# Altium project Lion tracker.PrjPCB
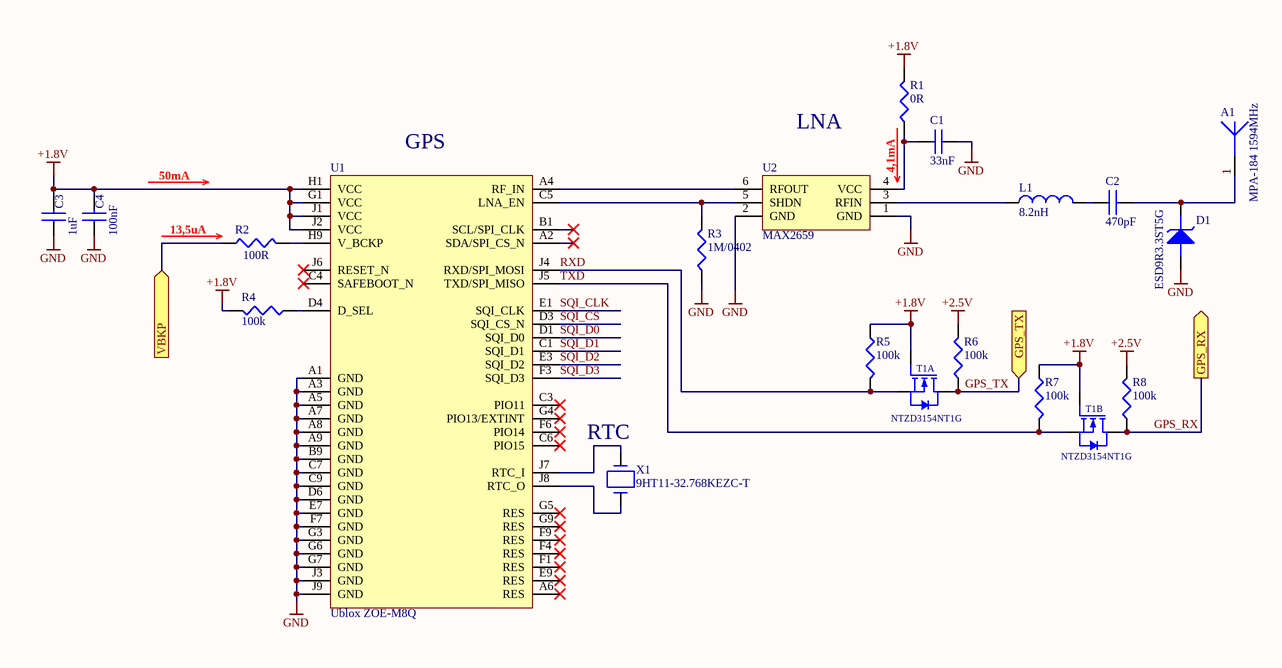
[diagram p0: GPS.SchDoc]
Company: IRNAS; CreateDate: 25.09.2019; PCBDesigner: Aleksej Cegner; ProjectTitle: Lion_Tracker; RevisionDate: 20.03.2019; Version: V1.4; Website: URL
1 sheet, 19 parts. Net scope: flat (ports and power ports of the same name join across sheets).
Board files: LION_TRACKER.PcbDoc, LION_TRACKER_PANEL.PcbDoc

## Sheet GPS.SchDoc
size A3; DocumentNumber: 3; SheetNumber: 3; SheetTotal: 5

### Parts
A1  MPA-184 1594MHz  [MPA-184]
C1  33nF  [CAP0402]
C2  470pF  [CAP0402]
C3  1uF  [CAP0402]
C4  100nF  [CAP0402]
D1  ESD9R3.3ST5G  [SOD-923]
L1  8.2nH  [IND0402]
R1  0R  [RES0402]
R2  100R  [RES0402]
R3  1M/0402  [RES0402]
R4  100k  [RES0402]
R5  100k  [RES0402]
R6  100k  [RES0402]
R7  100k  [RES0402]
R8  100k  [RES0402]
T1  NTZD3154NT1G  [SOT-563]  (parts A,B of 2)
U1  Ublox ZOE-M8Q  [S-LGA51]
U2  MAX2659  [uDFN-6]
X1  9HT11-32.768KEZC-T  [9HT11]

### Ports
GPS_RX (out), GPS_TX (in), VBKP (in)

### Nets
+1.8V: C3.2 C4.2 R1.2 R4.2 R5.1 R7.1 T1.2(G1) T1.5(G2) U1.G1(VCC) U1.H1(VCC) U1.J1(VCC) U1.J2(VCC)
+2.5V: R6.2 R8.2
GND: C1.1 C3.1 C4.1 D1.A(ANODE) R3.1 U1.A1(GND) U1.A3(GND) U1.A5(GND) U1.A7(GND) U1.A8(GND) U1.A9(GND) U1.B9(GND) U1.C7(GND) U1.C9(GND) U1.D6(GND) U1.E7(GND) U1.F7(GND) U1.G3(GND) U1.G6(GND) U1.G7(GND) U1.J3(GND) U1.J9(GND) U2.1(GND) U2.2(GND)
GPS_RX: R8.1 T1.3(D2) ; port GPS_RX
GPS_TX: R6.1 T1.6(D1) ; port GPS_TX
RXD: R5.2 T1.1(S1) U1.J4(RXD/SPI_MOSI)
SQI_CLK: U1.E1(SQI_CLK)
SQI_CS: U1.D3(SQI_CS_N)
SQI_D0: U1.D1(SQI_D0)
SQI_D1: U1.C1(SQI_D1)
SQI_D2: U1.E3(SQI_D2)
SQI_D3: U1.F3(SQI_D3)
TXD: R7.2 T1.4(S2) U1.J5(TXD/SPI_MISO)
VBKP: R2.1 ; port VBKP
NetA1_1: A1.1(ANT) C2.2 D1.K(cathode)
NetC1_2: C1.2 R1.1 U2.4(VCC)
NetC2_1: C2.1 L1.2
NetL1_1: L1.1 U2.3(RFIN)
NetR2_2: R2.2 U1.H9(V_BCKP)
NetR3_2: R3.2 U1.C5(LNA_EN) U2.5(SHDN)
NetR4_1: R4.1 U1.D4(D_SEL)
NetU1_A4: U1.A4(RF_IN) U2.6(RFOUT)
NetU1_J7: U1.J7(RTC_I) X1.2
NetU1_J8: U1.J8(RTC_O) X1.1

Not connected (* = marked no-connect by the designer): U1 A2(SDA/SPI_CS_N)* A6(RES)* B1(SCL/SPI_CLK)* C3(PIO11)* C4(SAFEBOOT_N)* C6(PIO15)* E9(RES)* F1(RES)* F4(RES)* F6(PIO14)* F9(RES)* G4(PIO13/EXTINT)* G5(RES)* G9(RES)* J6(RESET_N)*

### Notes on the sheet
- 50mA
- (near U1) GPS
- LNA
- 4,1mA
- (near R2) 13,5uA
- (near X1) RTC
- Size: A3
- Revision:
- Sheet
- of

### Library data of the parts
A1 = ANT - MAXTENA MPA-184 1594MHz: Antennas Passive GPS/GLONASS Patch Antenna; Manufacturer: Antenova; Manufacturer Part Number: SR42I010-R; Stock 1: 3154; Pricing 1: 1 = 2.36000, 10 = 1.90000, 50 = 1.90000, 100 = 1.52000, 1000 = 1.07000, 10000 = 0.95900 (USD); ComponentLink1Description: Datasheet; ComponentLink1URL: https://www.maxtena.com/wp-content/uploads/2018/09/maxtena_application_note_patch_antennas.pdf; Supplier 1: Digi-Key; Supplier Part Number 1: 931-1152-ND
C1 = C - 33pF/0402: 33 pF, 16 V,  5%, C0G / NP0, MC Series; Manufacturer: Multicomp; Manufacturer Part Number: MC0402N330J160CT; Capacitance: 33pF; Voltage Rating: 16V; Stock 1: 19597; Pricing 1: 10=0.011, 100=0.009, 500=0.0069, 2500=0.0041 (EUR); Case Code (Metric): 1005; Case Code (Imperial): 0402; Min Operating Temperature: -55°C; Max Operating Temperature: 125°C; Dielectric: C0G; Packaging: Cut Tape; Tolerance: 5%; Voltage Rating (DC): 16V; REACH SVHC: No SVHC; ComponentLink1URL: http://www.farnell.com/datasheets/2117933.pdf; ComponentLink1Description: http://www.farnell.com/datasheets/2117933.pdf; ComponentLink2URL: http://www.farnell.com/datasheets/2117900.pdf; ComponentLink2Description: http://www.farnell.com/datasheets/2117900.pdf; IRNAS Part No.: /; Supplier 1: Farnell; Supplier Part Number 1: 1759384
C2 = C - 470pF/0402: 470 pF, 50 V, 0402 [1005 Metric], ± 10%, X7R, GRT Series; Manufacturer: Murata; Manufacturer Part Number: GRT155R71H471KE01D; IRNAS Part No.: /; Stock 1: 11080; Pricing 1: 10=0.0259, 100=0.0176, 500=0.0105, 2500=0.008, 5000=0.007, 10000=0.006, 50000=0.0041 (GBP); Supplier 1: Farnell; Supplier Part Number 1: 2672128
C3 = C - 1uF/0402: CAP CER 1UF 10V 20% X5R 0402; Manufacturer: Murata; Manufacturer Part Number: GRM155R61A105ME15D; IRNAS Part No.: /; Stock 1: 0; Pricing 1: 10=0.0379, 100=0.0266, 500=0.0156, 2500=0.0098, 5000=0.0083 (EUR); Mount: Surface Mount; Case/Package: 0402; Case Code (Metric): 1005; Case Code (Imperial): 0402; Min Operating Temperature: -55°C; Max Operating Temperature: 85°C; Capacitance: 1uF; Tolerance: 20%; Voltage Rating: 10V; Packaging: Tape and Reel; Package Quantity: 1; Dielectric: X5R; Voltage: 10V; Voltage Rating (DC): 10V; Length: 1mm; Height: 0.5mm; Width: 0.02inch; Thickness: 0.022inch; Depth: 0.5mm; Radiation Hardening: No; REACH SVHC: No SVHC; Lead Free: Lead Free; ComponentLink1URL: https://datasheet.ciiva.com/164/product-164665.pdf; ComponentLink1Description: https://datasheet.ciiva.com/164/product-164665.pdf; ComponentLink2URL: https://datasheet.ciiva.com/11616/product-11616508.pdf; ComponentLink2Description: https://datasheet.ciiva.com/11616/product-11616508.pdf; ComponentLink3URL: https://datasheet.ciiva.com/46418/1769893-46418047.pdf; ComponentLink3Description: https://datasheet.ciiva.com/46418/1769893-46418047.pdf; ComponentLink4URL: https://datasheet.ciiva.com/164/partnumbering-e-01-164666.pdf; ComponentLink4Description: https://datasheet.ciiva.com/164/partnumbering-e-01-164666.pdf; ComponentLink5URL: https://datasheet.ciiva.com/164/partnumbering-e-01-164667.pdf; ComponentLink5Description: https://datasheet.ciiva.com/164/partnumbering-e-01-164667.pdf; Supplier 1: Farnell; Supplier Part Number 1: 1740588
C4 = C - 100nF/0402: 0.1 F, 16 V,  5%, X5R, MC Series; Manufacturer: Multicomp; Manufacturer Part Number: MC0402X104J160CT; IRNAS Part No.: /; Voltage Rating: 16V; Stock 1: 3230; Pricing 1: 10=0.0139, 100=0.0108, 500=0.0076, 2500=0.0051, 5000=0.0038 (EUR); Case Code (Metric): 1005; Case Code (Imperial): 0402; Min Operating Temperature: -55°C; Max Operating Temperature: 85°C; Capacitance: 100nF; Dielectric: X5R; Packaging: Tape and Reel; Tolerance: 5%; Voltage Rating (DC): 16V; REACH SVHC: No SVHC; ComponentLink1URL: http://www.farnell.com/datasheets/2117933.pdf; ComponentLink1Description: http://www.farnell.com/datasheets/2117933.pdf; ComponentLink2URL: http://www.farnell.com/datasheets/2117900.pdf; ComponentLink2Description: http://www.farnell.com/datasheets/2117900.pdf; Supplier 1: Farnell; Supplier Part Number 1: 2627419
D1 = D_TVS - ESD9R3.3ST5G: TVS Diode, ESD9R Series, Unidirectional, 3.3 V, 7.8 V; Manufacturer: DIODES INC.; Manufacturer Part Number: 1N4148W-7-F.; Diode Configuration: Single; Repetitive Reverse Voltage Vrrm Max: 100; Forward Current If(AV): 300; Forward Voltage VF Max: 1.25; Reverse Recovery Time trr Max: 4; Forward Surge Current Ifsm Max: 2; Diode Case Style: SOD-123; Product Range: 1N4148 Series; SVHC: No SVHC (17-Dec-2015); Diode Type: Switching; RoHS: YES; Stock 1: 157320; Pricing 1: 1=0.136, 25=0.132, 100=0.0465, 500=0.042, 1000=0.024, 3000=0.021, 9000=0.017, 30000=0.0149 (GBP); Operating Temperature Max: 150; No. of Pins: 2; Packaging: Cut Tape; Automotive Qualification Standard: -; MSL: MSL 1 - Unlimited; Operating Temperature Min: -65; Operating Temperature Range: -65°C to +150°C<!--FANDB--><div class="features-and-benefits-container"><div class="features-and-benefits-description"><span class="features-benefits-value">The 1N4148W-7-F is a surface mount fast Switching Diode with moulded plastic case. Suitable for general purpose switching applications.</span></div><div class="features-and-benefits-list"><ul class="features-and-benefits-list-list"><li class="features-and-benefits-list-item">Fast Switching Speed</li><li class="features-and-benefits-list-item">2; ComponentLink1URL: D:\altium\Altium_Library\Active\Datasheet\ESD9R33ST5G.pdf; ComponentLink1Description: Datasheet; Supplier 1: Farnell; Supplier Part Number 1: 2101835
L1 = L - 33nH/0402: High Frequency Inductor, 8.2 nH, LQG15HN Series, 300 mA, 0402 [1005 Metric], Multilayer, 0.33 ohm; Manufacturer: Murata; Manufacturer Part Number: LQG15HS33NJ02D; IRNAS Part No.: /; Core Material: Air; Tolerance: 5%; Q Factor: 8; Self Resonant Frequency: 1.6GHz; Current Rating: 200mA; Shielding: Unshielded; Inductance: 33nh; DC Resistance (DCR): 580mR; Test Frequency: 100MHz; Stock 1: 168013; Pricing 1: 1=0.1, 10=0.061, 100=0.0404, 500=0.0337, 1000=0.0283, 2500=0.0242 (USD); Mount: Surface Mount; Case/Package: 0402; Case Code (Metric): 1005; Case Code (Imperial): 0402; Min Operating Temperature: -55°C; Max Operating Temperature: 125°C; Package Quantity: 10000; Packaging: Tape and Reel; Max DC Current: 200mA; Termination: SMD/SMT; DC Current: 200mA; Military Standard: Not; Length: 1mm; Height: 0.5mm; Width: 0.5mm; Height - Seated (Max): 0.022inch; Depth: 0.55mm; Radiation Hardening: No; Lead Free: Lead Free; ComponentLink1URL: https://datasheet.ciiva.com/11799/0900766b8090d685-11799024.pdf; ComponentLink1Description: https://datasheet.ciiva.com/11799/0900766b8090d685-11799024.pdf; ComponentLink2URL: https://datasheet.ciiva.com/1038/l0075s0083lqg15hs-1038140.pdf; ComponentLink2Description: https://datasheet.ciiva.com/1038/l0075s0083lqg15hs-1038140.pdf; ComponentLink3URL: https://datasheet.ciiva.com/1038/l0075s0083lqg15hs-1038141.pdf; ComponentLink3Description: https://datasheet.ciiva.com/1038/l0075s0083lqg15hs-1038141.pdf; ComponentLink4URL: https://datasheet.ciiva.com/16207/l0075s0083lqg15hs-16207871.pdf; ComponentLink4Description: https://datasheet.ciiva.com/16207/l0075s0083lqg15hs-16207871.pdf; ComponentLink5URL: https://datasheet.ciiva.com/1038/l0075s0083lqg15hs-1038139.pdf; ComponentLink5Description: https://datasheet.ciiva.com/1038/l0075s0083lqg15hs-1038139.pdf; ComponentLink6URL: https://datasheet.ciiva.com/17279/l0075s0083lqg15hs-17279253.pdf; ComponentLink6Description: https://datasheet.ciiva.com/17279/l0075s0083lqg15hs-17279253.pdf; ComponentLink7URL: https://datasheet.ciiva.com/4977/o05e-4977560.pdf; ComponentLink7Description: https://datasheet.ciiva.com/4977/o05e-4977560.pdf; ComponentLink8URL: https://datasheet.ciiva.com/8510/l0075s0083lqg15hs-8510857.pdf; ComponentLink8Description: https://datasheet.ciiva.com/8510/l0075s0083lqg15hs-8510857.pdf; Supplier 1: Farnell; Supplier Part Number 1: 1343079
R1 = R - 0R/0402: RESISTOR, 0402, 0R, ANTI SULFURATION; Manufacturer: Multicomp; Manufacturer Part Number: MCMR04X000PTL; IRNAS Part No.: I-100016; Voltage Rating: 50V; Resistance: 0mR; Power Rating: 62.5mW; Temperature Coefficient: 400ppm/°C; Supplier 1: Farnell; Stock 1: 0; Pricing 1: 10=0.0057, 100=0.0034, 500=0.0024, 2500=0.0019, 5000=0.0015 (EUR); Case/Package: 0402; Case Code (Metric): 1005; Case Code (Imperial): 0402; Packaging: Cut Tape; Composition: Ceramic; Voltage Rating (DC): 50V; REACH SVHC: No SVHC; ComponentLink1URL: https://datasheet.ciiva.com/7776/1716705-7776974.pdf; ComponentLink1Description: https://datasheet.ciiva.com/7776/1716705-7776974.pdf; ComponentLink2URL: https://datasheet.ciiva.com/28677/1716705-28677161.pdf; ComponentLink2Description: https://datasheet.ciiva.com/28677/1716705-28677161.pdf; Supplier Part Number 1: 2072513
R2 = R - 100R/0402: 100 ohm, 50 V, 0402 [1005 Metric], 62.5 mW,  1%; Manufacturer: Multicomp; Manufacturer Part Number: MCMR04X1000FTL; IRNAS Part No.: /; Temperature Coefficient: 100ppm/°C; Power Rating: 62.5mW; Voltage Rating: 50V; Supplier 1: Farnell; Stock 1: 62365; Pricing 1: 10=0.0071, 100=0.0042, 500=0.003, 2500=0.0024, 5000=0.0019 (GBP); Case/Package: 0402; Case Code (Metric): 1005; Case Code (Imperial): 0402; Resistance: 100R; Tolerance: 1%; Composition: Ceramic; Packaging: Cut Tape; Voltage Rating (DC): 50V; REACH SVHC: No SVHC; ComponentLink1URL: https://datasheet.ciiva.com/28692/1716705-28692087.pdf; ComponentLink1Description: https://datasheet.ciiva.com/28692/1716705-28692087.pdf; ComponentLink2URL: https://datasheet.ciiva.com/22708/1716705-22708156.pdf; ComponentLink2Description: https://datasheet.ciiva.com/22708/1716705-22708156.pdf; Supplier Part Number 1: 2072515
R3 = R - 1M/0402: MCMR04X1004FTL RES, 1M, 1%, 0.0625W, 0402, THICK FILM; Manufacturer: MULTICOMP; Manufacturer Part Number: MC0063W060311M; IRNAS Part No.: I-100012; Resistance: 1; Voltage Rating: 50; Resistor Case Style: 0603 [1608 Metric]; Power Rating: 63; Product Range: MC Series; Temperature Coefficient: ± 100; SVHC: No SVHC (17-Dec-2015); External Depth: 0.45; External Length / Height: 1.6; External Width: 0.8; No. of Pins: 2; Reel Quantity: 5000; Resistor Mounting: Surface Mount Device; Temperature Coeff. +: 100; Voltage Rating V DC: 50V<!--FANDB--><div class="features-and-benefits-container"><div class="features-and-benefits-description"><span class="features-benefits-value">The Multicomp MC series current sense resistors are thick film chip resistors. The resistance range includes E96 and E24 decade values from 1ohm to 10Mohm.</span></div><div class="features-and-benefits-list"><ul class="features-and-benefits-list-list"><li class="features-and-benefits-list-item">EIA 0402, 0603, 0805, 1206 chip sizes available</li><li class="features-and-benefits-list-item">Small size and low weight</li><li class="features-and-benefits-list-item">Suitable for both wave and reflow soldering</li><li class="features-and-benefits-list-item">Reduction of assembly costs</li><li class="features-and-benefits-list-item">Maximum working voltage of 50V(0402, 0603), 150V(0805), 200V(1206)</li><li class="features-and-benefits-list-item">Available in ±1%, ±2% and ±5% tolerance</li><li class="features-and-benefits-list-item">Power rating of 62.5mW, 100mW and 125mW</li><li class="features-and-benefits-list-item">±400ppm/°C(1ohm to 10ohm), ±200ppm/°C(11ohm to 100ohm), ±100; Supplier 1: Farnell; RoHS: Y-EX; Stock 1: 333415; Pricing 1: 10=0.0011, 100=0.001, 500=0.0009, 1000=0.0008, 2500=0.0007 (GBP); Resistance Tolerance: ± 1%; Packaging: Cut Tape; Resistor Element Material: Thick Film; Automotive Qualification Standard: -; Operating Temperature Max: 155; Operating Temperature Min: -55; Operating Temperature Range: -55°C to +155; Tape Width: 8; Temperature Coeff. -: 100; Tolerance +: 1%; Tolerance -: 1%; ComponentLink1URL: http://www.farnell.com/datasheets/1788326.pdf; ComponentLink1Description: http://www.farnell.com/datasheets/1788326.pdf; ComponentLink2URL: http://www.farnell.com/cad/1558928.zip; ComponentLink2Description: http://www.farnell.com/cad/1558928.zip; Supplier Part Number 1: 9330410
R4-R8 = R - 100k/0402: 100KOHM, 1%, 0.0625W; Manufacturer: Multicomp; Manufacturer Part Number: MCWR04X1003FTL; IRNAS Part No.: I-100013; Resistance: 100kR; Power Rating: 62.5mW; Voltage Rating: 50V; Temperature Coefficient: 100ppm/°C; Supplier 1: Farnell; Stock 1: 161188; Pricing 1: 10=0.0029, 100=0.0017, 500=0.0012, 2500=0.001, 5000=0.0008 (EUR); Mount: Surface Mount; Case/Package: 0402; Case Code (Metric): 1005; Case Code (Imperial): 0402; Tolerance: 1%; Packaging: Cut Tape; Composition: Thick Film; Voltage Rating (DC): 50V; REACH SVHC: No SVHC; ComponentLink1URL: https://datasheet.ciiva.com/46386/1849611-46386524.pdf; ComponentLink1Description: https://datasheet.ciiva.com/46386/1849611-46386524.pdf; Supplier Part Number 1: 2447094
T1 = T_M - NTZD3154NT1G: Dual MOSFET, Dual N Channel, 540 mA, 20 V, 0.4 ohm, 4.5 V, 1 V; ELRAD Id sifra / ELRAD Id No: 597778; Opis / Description: MOSFET BSS123       /N-Channel; Komp / Device: SMD; Value: BSS123; Velikost / Size: SOT23; FIT: 0.44; Manufacturer Part Number: NTZD3154NT1G; Author: Ciril Golob; Date: 11.07.2018; ComponentLINK1Description: Datasheet; ComponentLINK2Description: Datasheet www; ComponentLINK1URL: c:\ELRADSVN\Altium_Library\Libraries\Active\Datasheet\BSS123.pdf; ComponentLINK2URL: http://www.onsemi.com/pub/Collateral/BSS123-D.PDF; Supplier 1: Farnell; Supplier Part Number 1: 2533209
U1 = RF - UBLOX-ZOE-M8B: ZOE-M8 RF Receiver BeiDou, Galileo, GLONASS, GNSS, GPS -160dBm; Manufacturer: u-blox; Manufacturer Part Number: MAX-M8Q-0; Stock 1: 10805; Supplier 1: Digi-Key; Supplier Part Number 1: 672-1063-1-ND
U2 = RF - MAX2659: RF Amplifier, GPS / GNSS, 20.5 dB Gain / 0.8 dB Noise, 1575.42 MHz, 1.6 V to 3.3 V Supply; Manufacturer: u-blox; Manufacturer Part Number: MAX-M8Q-0; Stock 1: 10805; ComponentLink1Description: Datasheet; ComponentLink1URL: D:\altium\Altium_Library\Active\Datasheet\MAX2659.pdf; Supplier 1: Farnell; Supplier Part Number 1: 2800966; Supplier 2: Mouser; Supplier Part Number 2: 700-MAX2659ELT+T
X1 = X - 9HT11-32.768KEZC-T: Crystal, 32.768 kHz, SMD, 2mm x 1.2mm, 9 pF, 10 ppm, 9HT11 Series; Manufacturer: IQD; Manufacturer Part Number: LFXTAL009678; IRNAS Part No.: /; Load Capacitance: 12.5pF; Frequency: 32.8kHz; Stock 1: 15609; Pricing 1: 5=0.283, 50=0.203, 250=0.169, 500=0.163, 1500=0.157, 3000=0.152, 15000=0.146 (EUR); Case/Package: 217; Number of Pins: 2; Min Operating Temperature: -40°C; Max Operating Temperature: 85°C; REACH SVHC: No SVHC; ComponentLink1URL: http://www.farnell.com/datasheets/1750031.pdf?_ga=2.80970644.2249963.1562564392-1373726713.1554121096&_gac=1.50020820.1562763802.CjwKCAjwmZbpBRAGEiwADrmVXm8xT8OHDZvJe8qZIQyyGmIuiUD-TEITatw0hIdDkyBwIXXCH7oneRoCl7cQAvD_BwE; ComponentLink1Description: Datasheet; Supplier 1: Farnell; Supplier Part Number 1: 2819312

## Assembly variants
BASIC: not fitted C10 C44 CON1 CON3 L4 R16 R22 R24 R32 TAB1 TAB3
BOM: not fitted CON1 P1 TP1 TP2 TP3 TP4 TP5
Wisent: not fitted C29 C30 C31 C32 C39 C40 C41 C42 C43 C44 C45 D3 D4 F1 L4 L6 R27 R28 R29 R30 R31 R32 R33 R35 R36 T4 T5 T6 TAB1 TAB3 U12 U13 U14